# EAGLE schematic baord1 (EAGLE 7.2.0)
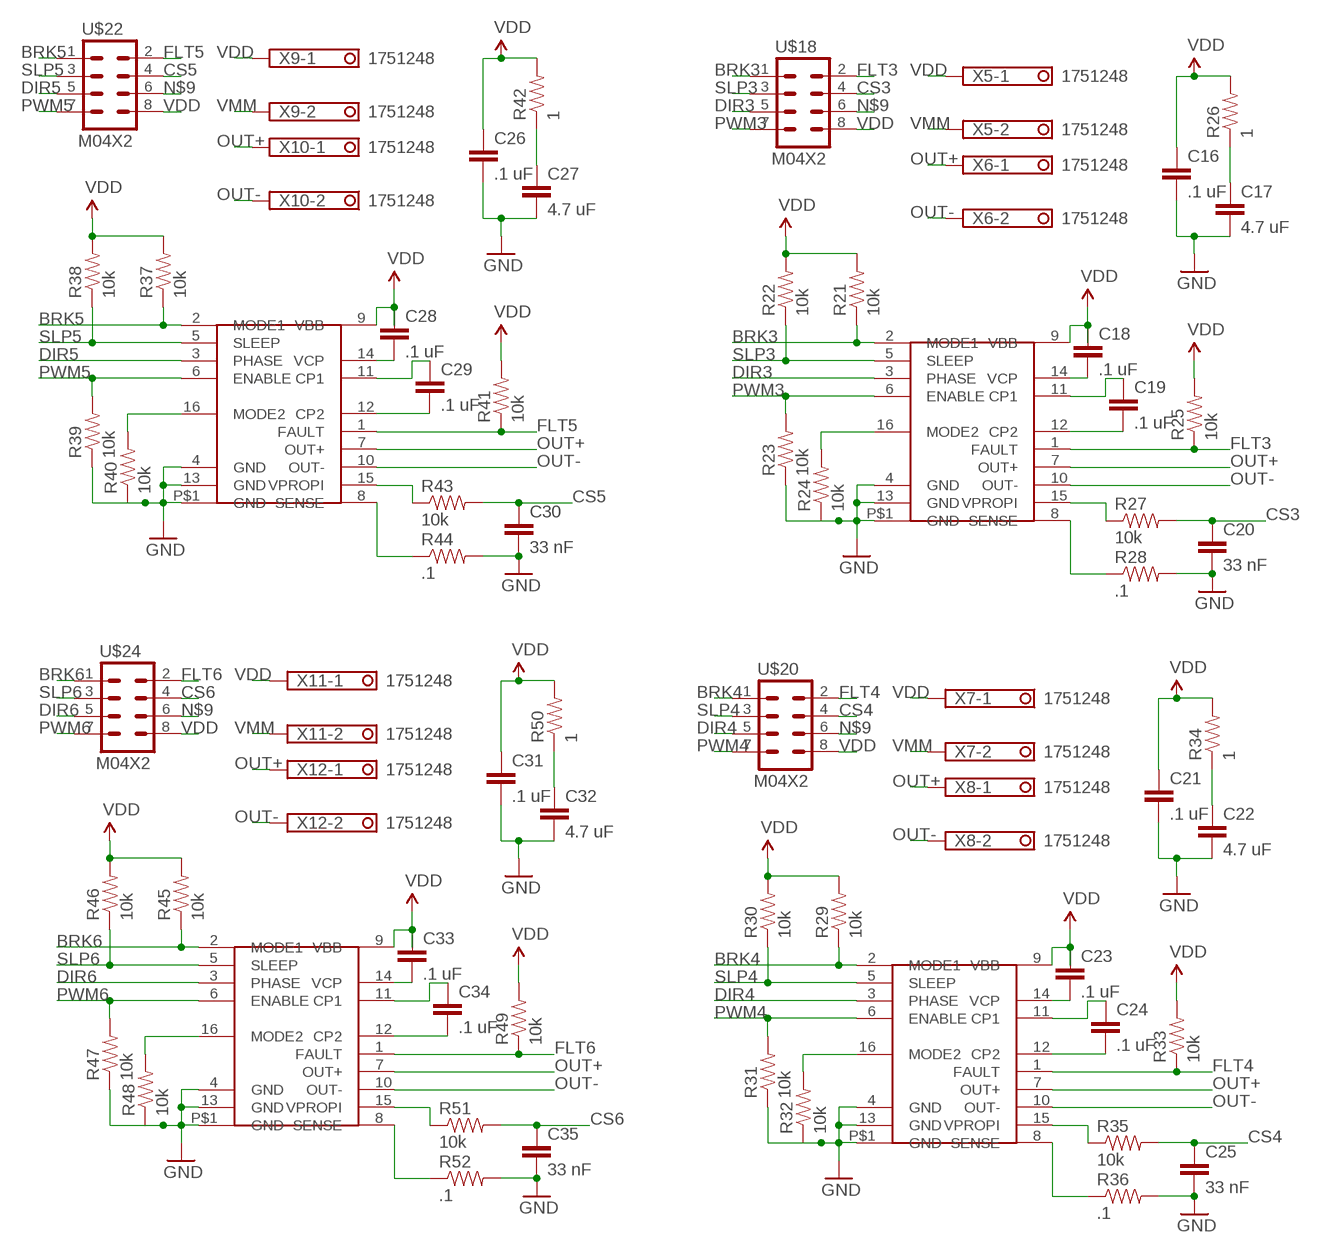
[diagram p0: schematic, sheet 1, part 1 of 2]
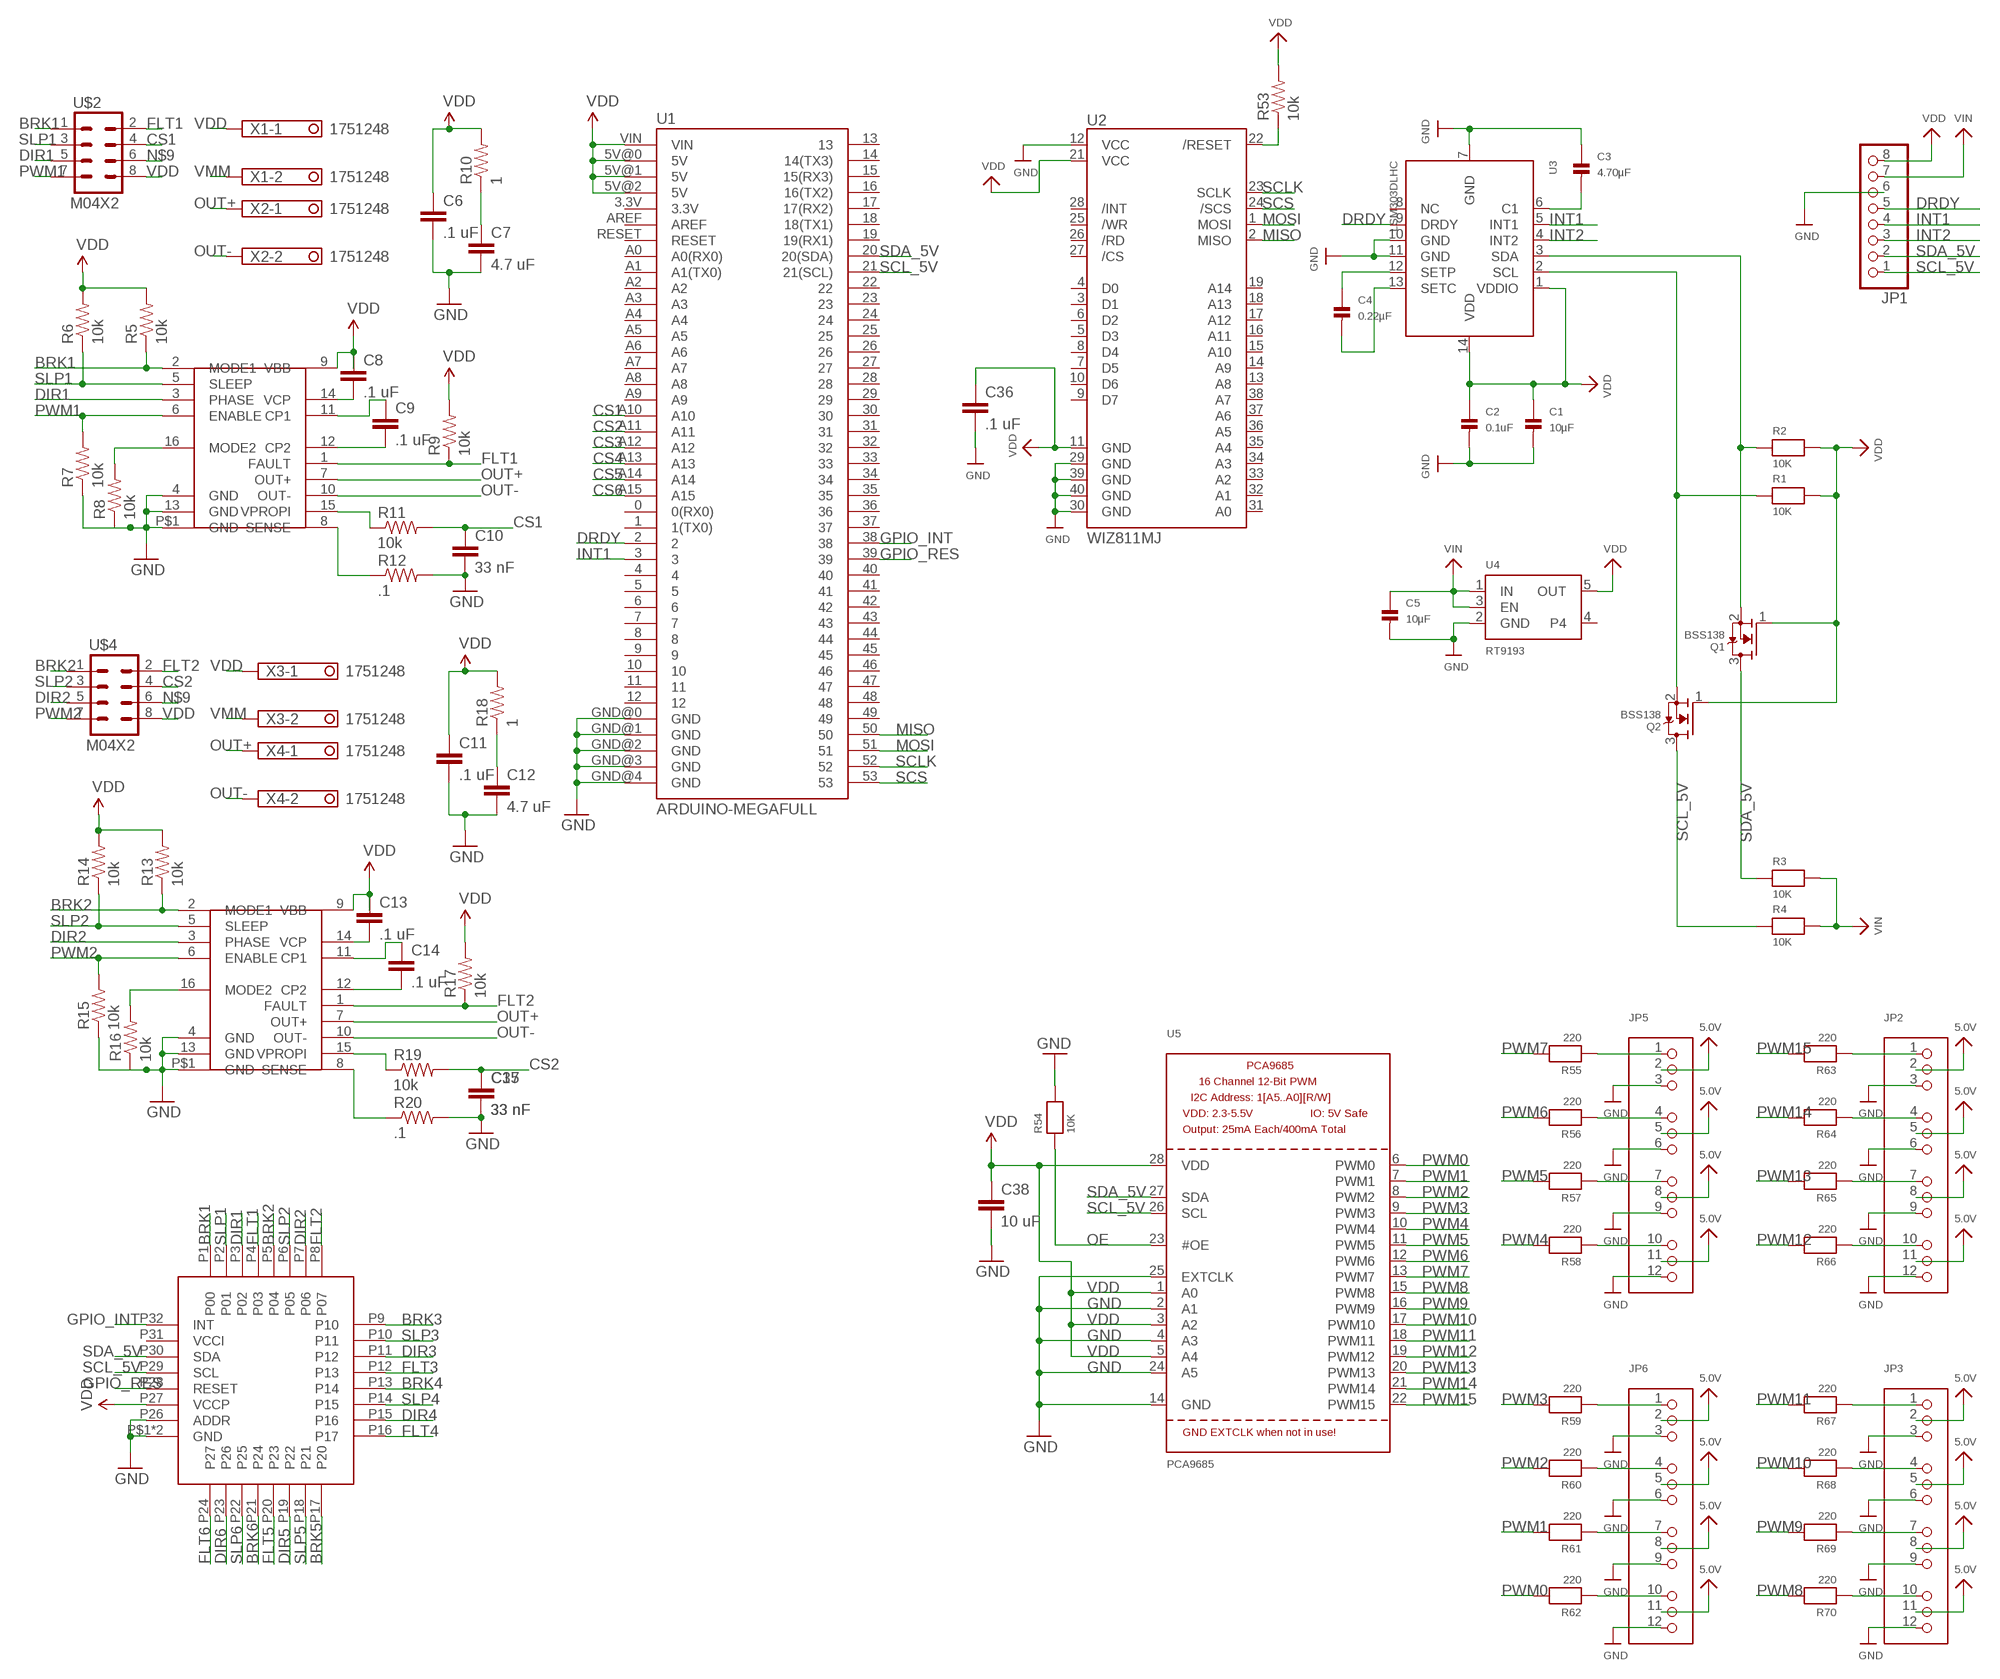
[diagram p1: schematic, sheet 1, part 2 of 2]

## Parts
C1  10µF  CAP_CERAMIC_0805  [_0805]
C2  0.1uF  CAP_CERAMIC_0805  [_0805]
C3  4.70µF  CAP_CERAMIC_0805  [_0805]
C4  0.22µF  CAP_CERAMIC_0805  [_0805]
C5  10µF  CAP_CERAMIC_0805  [_0805]
C6  .1 uF  CAPPTH  [CAP-PTH-SMALL]
C7  4.7 uF  CAPPTH  [CAP-PTH-SMALL]
C8  .1 uF  CAPPTH  [CAP-PTH-SMALL]
C9  .1 uF  CAPPTH  [CAP-PTH-SMALL]
C10  33 nF  CAPPTH  [CAP-PTH-SMALL]
C11  .1 uF  CAPPTH  [CAP-PTH-SMALL]
C12  4.7 uF  CAPPTH  [CAP-PTH-SMALL]
C13  .1 uF  CAPPTH  [CAP-PTH-SMALL]
C14  .1 uF  CAPPTH  [CAP-PTH-SMALL]
C15  33 nF  CAPPTH  [CAP-PTH-SMALL]
C16  .1 uF  CAPPTH  [CAP-PTH-SMALL]
C17  4.7 uF  CAPPTH  [CAP-PTH-SMALL]
C18  .1 uF  CAPPTH  [CAP-PTH-SMALL]
C19  .1 uF  CAPPTH  [CAP-PTH-SMALL]
C20  33 nF  CAPPTH  [CAP-PTH-SMALL]
C21  .1 uF  CAPPTH  [CAP-PTH-SMALL]
C22  4.7 uF  CAPPTH  [CAP-PTH-SMALL]
C23  .1 uF  CAPPTH  [CAP-PTH-SMALL]
C24  .1 uF  CAPPTH  [CAP-PTH-SMALL]
C25  33 nF  CAPPTH  [CAP-PTH-SMALL]
C26  .1 uF  CAPPTH  [CAP-PTH-SMALL]
C27  4.7 uF  CAPPTH  [CAP-PTH-SMALL]
C28  .1 uF  CAPPTH  [CAP-PTH-SMALL]
C29  .1 uF  CAPPTH  [CAP-PTH-SMALL]
C30  33 nF  CAPPTH  [CAP-PTH-SMALL]
C31  .1 uF  CAPPTH  [CAP-PTH-SMALL]
C32  4.7 uF  CAPPTH  [CAP-PTH-SMALL]
C33  .1 uF  CAPPTH  [CAP-PTH-SMALL]
C34  .1 uF  CAPPTH  [CAP-PTH-SMALL]
C35  33 nF  CAPPTH  [CAP-PTH-SMALL]
C36  .1 uF  CAPPTH  [CAP-PTH-SMALL]
C37  33 nF  CAPPTH  [CAP-PTH-SMALL]
C38  10 uF  CAPPTH  [CAP-PTH-SMALL]
JP1  HEADER-1X876MIL  [1X08_ROUND_76]
JP2  HEADER-3X04  [3X04]
JP3  HEADER-3X04  [3X04]
JP5  HEADER-3X04  [3X04]
JP6  HEADER-3X04  [3X04]
Q1  BSS138  MOSFET-NWIDE  [SOT23-WIDE]
Q2  BSS138  MOSFET-NWIDE  [SOT23-WIDE]
R1  10K  RESISTOR_0805  [_0805]
R2  10K  RESISTOR_0805  [_0805]
R3  10K  RESISTOR_0805  [_0805]
R4  10K  RESISTOR_0805  [_0805]
R5  10k  RESISTOR0603  [0603-RES]
R6  10k  RESISTOR0603  [0603-RES]
R7  10k  RESISTOR0603  [0603-RES]
R8  10k  RESISTOR0603  [0603-RES]
R9  10k  RESISTOR0603  [0603-RES]
R10  1  RESISTOR0603  [0603-RES]
R11  10k  RESISTOR0603  [0603-RES]
R12  .1  RESISTOR0603  [0603-RES]
R13  10k  RESISTOR0603  [0603-RES]
R14  10k  RESISTOR0603  [0603-RES]
R15  10k  RESISTOR0603  [0603-RES]
R16  10k  RESISTOR0603  [0603-RES]
R17  10k  RESISTOR0603  [0603-RES]
R18  1  RESISTOR0603  [0603-RES]
R19  10k  RESISTOR0603  [0603-RES]
R20  .1  RESISTOR0603  [0603-RES]
R21  10k  RESISTOR0603  [0603-RES]
R22  10k  RESISTOR0603  [0603-RES]
R23  10k  RESISTOR0603  [0603-RES]
R24  10k  RESISTOR0603  [0603-RES]
R25  10k  RESISTOR0603  [0603-RES]
R26  1  RESISTOR0603  [0603-RES]
R27  10k  RESISTOR0603  [0603-RES]
R28  .1  RESISTOR0603  [0603-RES]
R29  10k  RESISTOR0603  [0603-RES]
R30  10k  RESISTOR0603  [0603-RES]
R31  10k  RESISTOR0603  [0603-RES]
R32  10k  RESISTOR0603  [0603-RES]
R33  10k  RESISTOR0603  [0603-RES]
R34  1  RESISTOR0603  [0603-RES]
R35  10k  RESISTOR0603  [0603-RES]
R36  .1  RESISTOR0603  [0603-RES]
R37  10k  RESISTOR0603  [0603-RES]
R38  10k  RESISTOR0603  [0603-RES]
R39  10k  RESISTOR0603  [0603-RES]
R40  10k  RESISTOR0603  [0603-RES]
R41  10k  RESISTOR0603  [0603-RES]
R42  1  RESISTOR0603  [0603-RES]
R43  10k  RESISTOR0603  [0603-RES]
R44  .1  RESISTOR0603  [0603-RES]
R45  10k  RESISTOR0603  [0603-RES]
R46  10k  RESISTOR0603  [0603-RES]
R47  10k  RESISTOR0603  [0603-RES]
R48  10k  RESISTOR0603  [0603-RES]
R49  10k  RESISTOR0603  [0603-RES]
R50  1  RESISTOR0603  [0603-RES]
R51  10k  RESISTOR0603  [0603-RES]
R52  .1  RESISTOR0603  [0603-RES]
R53  10k  RESISTOR0603  [0603-RES]
R54  10K  RESISTOR_0805  [_0805]
R55  220  RESISTOR_0805  [_0805]
R56  220  RESISTOR_0805  [_0805]
R57  220  RESISTOR_0805  [_0805]
R58  220  RESISTOR_0805  [_0805]
R59  220  RESISTOR_0805  [_0805]
R60  220  RESISTOR_0805  [_0805]
R61  220  RESISTOR_0805  [_0805]
R62  220  RESISTOR_0805  [_0805]
R63  220  RESISTOR_0805  [_0805]
R64  220  RESISTOR_0805  [_0805]
R65  220  RESISTOR_0805  [_0805]
R66  220  RESISTOR_0805  [_0805]
R67  220  RESISTOR_0805  [_0805]
R68  220  RESISTOR_0805  [_0805]
R69  220  RESISTOR_0805  [_0805]
R70  220  RESISTOR_0805  [_0805]
U1  ARDUINO-MEGAFULL  [ARDUINO_MEGA]
U2  WIZ811MJ  [WIZ811MJ]
U3  LSM303DLHC  [LGA14]
U4  RT9193  VREG_SOT23-5  [SOT23-5]
U5  PCA9685  [TSSOP28]
U$1  DRV8801PWP  [TSSOP16]
U$2  M04X2  [2X4]
U$3  DRV8801PWP  [TSSOP16]
U$4  M04X2  [2X4]
U$17  DRV8801PWP  [TSSOP16]
U$18  M04X2  [2X4]
U$19  DRV8801PWP  [TSSOP16]
U$20  M04X2  [2X4]
U$21  DRV8801PWP  [TSSOP16]
U$22  M04X2  [2X4]
U$23  DRV8801PWP  [TSSOP16]
U$24  M04X2  [2X4]
U$63  TCA6424A  [PQFN32]
X1  1751248  [1751248]
X2  1751248  [1751248]
X3  1751248  [1751248]
X4  1751248  [1751248]
X5  1751248  [1751248]
X6  1751248  [1751248]
X7  1751248  [1751248]
X8  1751248  [1751248]
X9  1751248  [1751248]
X10  1751248  [1751248]
X11  1751248  [1751248]
X12  1751248  [1751248]

## Nets
5.0V: JP2.2 JP2.5 JP2.8 JP2.11 JP3.2 JP3.5 JP3.8 JP3.11 JP5.2 JP5.5 JP5.8 JP5.11 JP6.2 JP6.5 JP6.8 JP6.11
BRK1: R5.1 U$1.2(MODE1) U$2.1 U$63.P1(P00)
BRK2: R13.1 U$3.2(MODE1) U$4.1 U$63.P5(P04)
BRK3: R21.1 U$17.2(MODE1) U$18.1 U$63.P9(P10)
BRK4: R29.1 U$19.2(MODE1) U$20.1 U$63.P13(P14)
BRK5: R37.1 U$21.2(MODE1) U$22.1 U$63.P17(P20)
BRK6: R45.1 U$23.2(MODE1) U$24.1 U$63.P21(P24)
CS1: C10.1 R11.2 U1.A10 U$2.4
CS2: C15.1 C37.1 R19.2 U1.A11 U$4.4
CS3: C20.1 R27.2 U1.A12 U$18.4
CS4: C25.1 R35.2 U1.A13 U$20.4
CS5: C30.1 R43.2 U1.A14 U$22.4
CS6: C35.1 R51.2 U1.A15 U$24.4
DIR1: U$1.3(PHASE) U$2.5 U$63.P3(P02)
DIR2: U$3.3(PHASE) U$4.5 U$63.P7(P06)
DIR3: U$17.3(PHASE) U$18.5 U$63.P11(P12)
DIR4: U$19.3(PHASE) U$20.5 U$63.P15(P16)
DIR5: U$21.3(PHASE) U$22.5 U$63.P19(P22)
DIR6: U$23.3(PHASE) U$24.5 U$63.P23(P26)
DRDY: JP1.5 U1.2 U3.9(DRDY)
FLT1: R9.1 U$1.1(FAULT) U$2.2 U$63.P4(P03)
FLT2: R17.1 U$3.1(FAULT) U$4.2 U$63.P8(P07)
FLT3: R25.1 U$17.1(FAULT) U$18.2 U$63.P12(P13)
FLT4: R33.1 U$19.1(FAULT) U$20.2 U$63.P16(P17)
FLT5: R41.1 U$21.1(FAULT) U$22.2 U$63.P20(P23)
FLT6: R49.1 U$23.1(FAULT) U$24.2 U$63.P24(P27)
GND: C1.2 C2.2 C3.1 C5.2 C6.2 C7.2 C10.2 C11.2 C12.2 C15.2 C16.2 C17.2 C20.2 C21.2 C22.2 C25.2 C26.2 C27.2 C30.2 C31.2 C32.2 C35.2 C36.2 C37.2 C38.2 JP1.6 JP2.3 JP2.6 JP2.9 JP2.12 JP3.3 JP3.6 JP3.9 JP3.12 JP5.3 JP5.6 JP5.9 JP5.12 JP6.3 JP6.6 JP6.9 JP6.12 R7.1 R8.1 R12.2 R15.1 R16.1 R20.2 R23.1 R24.1 R28.2 R31.1 R32.1 R36.2 R39.1 R40.1 R44.2 R47.1 R48.1 R52.2 R54.2 U1.GND@0(GND) U1.GND@1(GND) U1.GND@2(GND) U1.GND@3(GND) U1.GND@4(GND) U2.12(VCC) U2.29(GND) U2.30(GND) U2.39(GND) U2.40(GND) U3.7(GND) U3.10(GND) U3.11(GND) U4.2(GND) U5.2(A1) U5.4(A3) U5.14(GND) U5.24(A5) U5.25(EXTCLK) U$1.4(GND) U$1.13(GND) U$1.P$1(GND) U$3.4(GND) U$3.13(GND) U$3.P$1(GND) U$17.4(GND) U$17.13(GND) U$17.P$1(GND) U$19.4(GND) U$19.13(GND) U$19.P$1(GND) U$21.4(GND) U$21.13(GND) U$21.P$1(GND) U$23.4(GND) U$23.13(GND) U$23.P$1(GND) U$63.P25(GND) U$63.P26(ADDR) U$63.P$1(GND)
GPIO_INT: U1.38 U$63.P32(INT)
GPIO_RES: U1.39 U$63.P28(RESET)
INT1: JP1.4 U1.3 U3.5(INT1)
INT2: JP1.3 U3.4(INT2)
MISO: U1.50 U2.2(MISO)
MOSI: U1.51 U2.1(MOSI)
N$1: Q1.2(S) R2.1 U3.3(SDA)
N$2: Q2.2(S) R1.1 U3.2(SCL)
N$3: C3.2 U3.6(C1)
N$4: C4.1 U3.12(SETP)
N$5: C4.2 U3.13(SETC)
N$6: R8.2 U$1.16(MODE2)
N$7: R12.1 U$1.8(SENSE)
N$8: R19.1 U$3.15(VPROPI)
N$9: U$2.6 U$4.6 U$18.6 U$20.6 U$22.6 U$24.6
N$10: C13.2 U$3.14(VCP)
N$11: C14.1 U$3.11(CP1)
N$12: C14.2 U$3.12(CP2)
N$13: C12.1 R18.1
N$14: R16.2 U$3.16(MODE2)
N$15: R20.1 U$3.8(SENSE)
N$16: R11.1 U$1.15(VPROPI)
N$17: R27.1 U$17.15(VPROPI)
N$18: C8.2 U$1.14(VCP)
N$19: C9.1 U$1.11(CP1)
N$20: C9.2 U$1.12(CP2)
N$21: C18.2 U$17.14(VCP)
N$22: C7.1 R10.1
N$23: C19.1 U$17.11(CP1)
N$24: C19.2 U$17.12(CP2)
N$25: C17.1 R26.1
N$26: R24.2 U$17.16(MODE2)
N$27: R28.1 U$17.8(SENSE)
N$28: R35.1 U$19.15(VPROPI)
N$29: C23.2 U$19.14(VCP)
N$30: C24.1 U$19.11(CP1)
N$31: C24.2 U$19.12(CP2)
N$32: C22.1 R34.1
N$33: R32.2 U$19.16(MODE2)
N$34: R36.1 U$19.8(SENSE)
N$35: R43.1 U$21.15(VPROPI)
N$36: C28.2 U$21.14(VCP)
N$37: C29.1 U$21.11(CP1)
N$38: C29.2 U$21.12(CP2)
N$39: C27.1 R42.1
N$40: R40.2 U$21.16(MODE2)
N$41: R44.1 U$21.8(SENSE)
N$42: R51.1 U$23.15(VPROPI)
N$43: C33.2 U$23.14(VCP)
N$44: C34.1 U$23.11(CP1)
N$45: C34.2 U$23.12(CP2)
N$46: C32.1 R50.1
N$47: R48.2 U$23.16(MODE2)
N$48: R52.1 U$23.8(SENSE)
N$49: R53.1 U2.22(/RESET)
N$50: JP3.10 R70.1
N$51: JP3.7 R69.1
N$52: JP6.10 R62.1
N$53: JP6.7 R61.1
N$54: JP6.4 R60.1
N$55: JP6.1 R59.1
N$56: JP5.10 R58.1
N$57: JP5.7 R57.1
N$58: JP5.4 R56.1
N$59: JP5.1 R55.1
N$60: JP3.4 R68.1
N$61: JP3.1 R67.1
N$62: JP2.10 R66.1
N$63: JP2.7 R65.1
N$64: JP2.4 R64.1
N$65: JP2.1 R63.1
OE: R54.1 U5.23(#OE)
OUT+: U$1.7(OUT+) U$3.7(OUT+) U$17.7(OUT+) U$19.7(OUT+) U$21.7(OUT+) U$23.7(OUT+) X2.1 X4.1 X6.1 X8.1 X10.1 X12.1
OUT-: U$1.10(OUT-) U$3.10(OUT-) U$17.10(OUT-) U$19.10(OUT-) U$21.10(OUT-) U$23.10(OUT-) X2.2 X4.2 X6.2 X8.2 X10.2 X12.2
PWM0: R62.2 U5.6(PWM0)
PWM1: R7.2 R61.2 U5.7(PWM1) U$1.6(ENABLE) U$2.7
PWM2: R15.2 R60.2 U5.8(PWM2) U$3.6(ENABLE) U$4.7
PWM3: R23.2 R59.2 U5.9(PWM3) U$17.6(ENABLE) U$18.7
PWM4: R31.2 R58.2 U5.10(PWM4) U$19.6(ENABLE) U$20.7
PWM5: R39.2 R57.2 U5.11(PWM5) U$21.6(ENABLE) U$22.7
PWM6: R47.2 R56.2 U5.12(PWM6) U$23.6(ENABLE) U$24.7
PWM7: R55.2 U5.13(PWM7)
PWM8: R70.2 U5.15(PWM8)
PWM9: R69.2 U5.16(PWM9)
PWM10: R68.2 U5.17(PWM10)
PWM11: R67.2 U5.18(PWM11)
PWM12: R66.2 U5.19(PWM12)
PWM13: R65.2 U5.20(PWM13)
PWM14: R64.2 U5.21(PWM14)
PWM15: R63.2 U5.22(PWM15)
SCL_5V: JP1.1 Q2.3(D) R4.1 U1.21(21(SCL)) U5.26(SCL) U$63.P29(SCL)
SCLK: U1.52 U2.23(SCLK)
SCS: U1.53 U2.24(/SCS)
SDA_5V: JP1.2 Q1.3(D) R3.1 U1.20(20(SDA)) U5.27(SDA) U$63.P30(SDA)
SLP1: R6.1 U$1.5(SLEEP) U$2.3 U$63.P2(P01)
SLP2: R14.1 U$3.5(SLEEP) U$4.3 U$63.P6(P05)
SLP3: R22.1 U$17.5(SLEEP) U$18.3 U$63.P10(P11)
SLP4: R30.1 U$19.5(SLEEP) U$20.3 U$63.P14(P15)
SLP5: R38.1 U$21.5(SLEEP) U$22.3 U$63.P18(P21)
SLP6: R46.1 U$23.5(SLEEP) U$24.3 U$63.P22(P25)
VDD: C1.1 C2.1 C6.1 C8.1 C11.1 C13.1 C16.1 C18.1 C21.1 C23.1 C26.1 C28.1 C31.1 C33.1 C36.1 C38.1 JP1.8 Q1.1(G) Q2.1(G) R1.2 R2.2 R5.2 R6.2 R9.2 R10.2 R13.2 R14.2 R17.2 R18.2 R21.2 R22.2 R25.2 R26.2 R29.2 R30.2 R33.2 R34.2 R37.2 R38.2 R41.2 R42.2 R45.2 R46.2 R49.2 R50.2 R53.2 U1.5V@0(5V) U1.5V@1(5V) U1.5V@2(5V) U1.VIN U2.11(GND) U2.21(VCC) U3.1(VDDIO) U3.14(VDD) U4.5(OUT) U5.1(A0) U5.3(A2) U5.5(A4) U5.28(VDD) U$1.9(VBB) U$2.8 U$3.9(VBB) U$4.8 U$17.9(VBB) U$18.8 U$19.9(VBB) U$20.8 U$21.9(VBB) U$22.8 U$23.9(VBB) U$24.8 U$63.P27(VCCP) X1.1 X3.1 X5.1 X7.1 X9.1 X11.1
VIN: C5.1 JP1.7 R3.2 R4.2 U4.1(IN) U4.3(EN)
VMM: X1.2 X3.2 X5.2 X7.2 X9.2 X11.2
Unconnected: U1.0(0(RX0)) U1.1(1(TX0)) U1.3.3V U1.4 U1.5 U1.6 U1.7 U1.8 U1.9 U1.10 U1.11 U1.12 U1.13 U1.14(14(TX3)) U1.15(15(RX3)) U1.16(16(TX2)) U1.17(17(RX2)) U1.18(18(TX1)) U1.19(19(RX1)) U1.22 U1.23 U1.24 U1.25 U1.26 U1.27 U1.28 U1.29 U1.30 U1.31 U1.32 U1.33 U1.34 U1.35 U1.36 U1.37 U1.40 U1.41 U1.42 U1.43 U1.44 U1.45 U1.46 U1.47 U1.48 U1.49 U1.A0(A0(RX0)) U1.A1(A1(TX0)) U1.A2 U1.A3 U1.A4 U1.A5 U1.A6 U1.A7 U1.A8 U1.A9 U1.AREF U1.RESET U2.3(D1) U2.4(D0) U2.5(D3) U2.6(D2) U2.7(D5) U2.8(D4) U2.9(D7) U2.10(D6) U2.13(A8) U2.14(A9) U2.15(A10) U2.16(A11) U2.17(A12) U2.18(A13) U2.19(A14) U2.25(/WR) U2.26(/RD) U2.27(/CS) U2.28(/INT) U2.31(A0) U2.32(A1) U2.33(A2) U2.34(A3) U2.35(A4) U2.36(A5) U2.37(A6) U2.38(A7) U3.8(NC) U4.4 U$63.P31(VCCI)

## Library data of the parts
C1-C5 = microbuilder:CAP_CERAMIC: Ceramic Capacitors 0402 - 0402 Surface Mount Capacitors 16pF 50V 5% [Digikey: 445-4899-2-ND] 18pF 50V 5% [Digikey: 490-1281-2-ND] 22pF 50V 5% [Digikey: 490-1283-2-ND] 68pF 50V 5% [Digikey: 490-1289-2-ND] 0.1uF 10V 10% [Digikey: 490-1318-2-ND] 1.0uF 6.3V 10% [Digikey: 490-1320-2-ND] 0603 - 0603 Surface Mount Capacitors 16 pF 50V 5% [Digikey: 445-5051-2-ND] 22 pF 50V [Digikey: PCC220ACVTR-ND] 33 pF 50V 5% [Digikey: 490-1415-1-ND] 56pF 50V 5% [Digikey: 490-1421-1-ND] 220pF 50V 5% [Digikey: 445-1285-1-ND] 680 pF 50V 2200 pF 50V 5% C0G [Digikey: 445-1297-1-ND] 5600 pF 100V 5% X7R [Digikey: 478-3711-1-ND] 0.1 µF 25V 10% [Digikey: PCC2277TR-ND] 0.22 µF 16V 10% X7R [Digikey: 445-1318-1-ND] 1.0 µF 25V 10% [Digikey: 445-5146-2-ND] 0603 - RF Specific 3pF 250V +/-0.1pF RF [Digikey: 712-1347-1-ND] 18 pF 250V 5% [Digikey: 478-3505-1-ND or 712-1322-1-ND] 56 pF 250V 5% C0G RF [Digikey: 490-4867-1-ND] 68 pF 250V RF [Digikey: 490-4868-1-ND] 0805 - 0805 Surface Mount Capacitors 220 pF 250V 2% RF Ceramic Capacitor [Digikey: 712-1398-1-ND] 1000 pF 50V 2% NP0 Ceramic Capacitor [Digikey: 478-3760-1-ND] 0.1 µF 25V 10% Ceramic Capacitor [Digikey: PCC1828TR-ND] 1.0 µF 16V 10% Ceramic Capacitor[Digikey: 490-1691-2-ND] 10.0 µF 10V 10% Ceramic Capacitor[Digikey: 709-1228-1-ND] 10.0 uF 16V 10% Ceramic Capacitor [Digikey: 478-5165-2-ND] 47 uF 6.3V 20% Ceramic Capacitor [Digikey: 587-1779-1-ND or 399-5506-1-ND] 1206 - 1206 Surface Mount Capacitors 47uF 10V 20% Ceramic Capacitor [Digikey: 490-5528-1-ND or 399-5508-1-ND or 445-6010-1-ND] 100uF 6.3V -20%, +80% Y5V Ceramic Capacitor (Digikey: 490-4512-1-ND, Mouser: 81-GRM31CF50J107ZE1L)
C6-C38 = SparkFun-Capacitors:CAP: Capacitor Standard 0603 ceramic capacitor, and 0.1" leaded capacitor.
JP1 = microbuilder:HEADER-1X8: PIN HEADER
JP2 JP3 JP5 JP6 = microbuilder:HEADER-3X04
Q1 Q2 = microbuilder:MOSFET-N: N-Channel Mosfet LEGEND VDS: Voltage Drain-Source ID: Drain Current RDS(ON): Drain-Source On-State Resistance VGS(TH): Gate-Source Threshold Voltage CISS: Drain-Source Input Capacitance SOT-23 Name VDS ID RDS(ON) VGS(TH) CISS Order Number 2N7002E 60V 260mA 2.5 Ohm 2.5V @ 250uA 26.7pF @ 25V 2N7002ET1GOSTR-ND BSH103 30V 850mA 400 mOhm 400mV @ 1mA 83pF @ 24V BSH103,235-ND BSS138 60V 320mA 1.6 Ohm 1.5V @ 250uA 50pF @ 10V Mouser: 771-BSS138PW115 DMN2075U-7 20V 4.2A 38 mOhm 1V @ 250 uA 594.3pF @ 10V DMN2075U-7DICT-ND * BSS138 good choice for I2C level-shifting
R1-R4 R54-R70 = microbuilder:RESISTOR: Resistors 0402 - 0402 Surface Mount Package 22 Ohm 1% 1/16W [Digikey: 311-22.0LRTR-ND] 33 Ohm 5% 1/16W 1.0K 5% 1/16W 1.5K 5% 1/16W 2.0K 1% 1/16W 10.0K 1% 1/16W [Digikey: 311-10.0KLRTR-ND] 10.0K 5% 1/16W [Digikey: RMCF0402JT10K0TR-ND] 12.1K 1% 1/16W [Digikey: 311-22.0LRTR-ND] 100.0K 5% 1/16W 0603 - 0603 Surface Mount Package 0 Ohm 1/10 Watt 1% Resistor 15 Ohm 1/10 Watt 1% Resistor 33 Ohm 1/10 Watt 1% Resistor 49.9 Ohm 1/10 Watt 1% Resistor 100 Ohm 1/10 Watt 1% Resistor 150 Ohm 1/10 Watt 1% Resistor 240 Ohm 1/10 Watt 1% Resistor 390 Ohm 1/10 Watt 1% Resistor 560 Ohm 1/10 Watt 1% Resistor 680 Ohm 1/10 Watt 1% Resistor 750 Ohm 1/10 Watt 1% Resistor 1.0K Ohm 1/10 Watt 1% Resistor 1.5K Ohm 1/10 Watt 1% Resistor 2.0K Ohm 1/10 Watt 1% Resistor 2.2K Ohm 1/10 Watt 1% Resistor 3.3K Ohm 1/10 Watt 1% Resistor 4.7K Ohm 1/10 Watt 1% Resistor 10.0K Ohm 1/10 Watt 1% Resistor 12.0K Ohm 1/10 Watt 1% Resistor 12.1K Ohm 1/10 Watt 1% Resistor 20.0K Ohm 1/10 Watt 1% Resistor 33.0K Ohm 1/10 Watt 1% Resistor 100.0K Ohm 1/10 Watt 1% Resistor 0805 - 0805 Surface Mount Package 0 Ohm 1/8 Watt 1% Resistor 33 Ohm 1/8 Watt 1% Resistor 100 Ohm 1/8 Watt 1% Resistor 150 Ohm 1/8 Watt 1% Resistor 200 Ohm 1/8 Watt 1% Resistor 240 Ohm 1/8 Watt 1% Resistor 330 Ohm 1/8 Watt 1% Resistor 390 Ohm 1/8 Watt 1% Resistor 470 Ohm 1/8 Watt 1% Resistor 1.0K Ohm 1/8 Watt 1% Resistor 1.5K Ohm 1/8 Watt 1% Resistor 2.0K Ohm 1/8 Watt 1% Resistor 4.7K Ohm 1/8 Watt 1% Resistor 5.1K Ohm 1/8 Watt 1% Resistor 5.6K Ohm 1/8 Watt 1% Resistor 10.0K Ohm 1/8 Watt 1% Resistor 22.0K Ohm 1/8 Watt 1% Resistor 33.0K Ohm 1/8 Watt 1% Resistor 100K Ohm 1/8 Watt 1% Resistor 1206 - 1206 Surface Mount Package 2012 - 2010 Surface Mount Package 0.11 Ohm 1/2 Watt 1% Resistor - Digikey: RHM.11UCT-ND
R5-R53 = SparkFun-Resistors:RESISTOR: Resistor Basic schematic elements and footprints for 0603, 1206, and PTH resistors.
U1 = SparkFun-Boards:ARDUINO-MEGA: Arduino Mega board footprint
U2 = SparkFun-Boards:WIZ811MJ: WIZnet W5100 Network Module with MagJack - WIZ811MJ WIZnet's WIZ811MJ is a breakout board for the W5100 embedded TCP/IP chip. Also included on the board is a RJ-45 MagJack Connector (RJ45 with X'FMR). See http://www.sparkfun.com/commerce/product_info.php?products_id=9473 for more documentation and info. **UNPROVEN
U3 = microbuilder:LSM303DLHC: LSM303DLHC 3-Axis I2C Accelerometer and 3-Axis Magnetometer VDD: 2.2-3.6V VDDIO: 1.8-VDD Magnetic Range: +/-1.3 to +/-8.1 gauss Accel Range: +/-2/4/8/16 g Temp: -40 - 85°C
U4 = microbuilder:VREG_SOT23-5: SOT23-5 Fixed Voltage Regulators To better organise some of the SOT23-5 fixed voltage regulators in this library, this new part was created. Part Current Out V Out V In V Dropout Digikey Part No. ADP121 150mA 3.3V 3.4-5.5V 0.09V @ 150mA ADP121-AUJZ33R7CT-ND ADP121 150mA 3.0V 3.1-5.5V 0.09V @ 150mA ADP121-AUJZ30R7CT-ND ADP122 300mA 3.3V 3.4-5.5V 0.085V @ 300mA ADP122AUJZ-3.3-R7CT-ND ADP1712 300mA 3.3V 3.5-5.5V 0.17V @ 300mA ADP1712AUJZ-3.3-R7TR-ND AP7311 (Low Cost) 150mA 3.3V 3.5-6V 0.15V @ 150mA AP7311-33WG-7DICT-ND LD39015M18R 150mA 1.8V 1.9V-5.5V 0.08V @ 100mA 497-6977-1-ND MCP1824T-3302E/OT 300mA 3.3V 3.5V-6V 0.2V @ 300mA MCP1824T-3302E/OTCT-ND MIC5205-2.5YM5 TR 150mA 2.5V 2.7-16V 0.165V @ 150mA 576-1257-2-ND MIC5205-3.0YM5 TR 150mA 3.0V 3.2V-16V 0.165V @ 150mA 576-1258-2-ND MIC5205-3.3YM5 TR 150mA 3.3V 3.5V-16V 0.165V @ 150mA 576-1259-2-ND TPS780330220 150mA 3.3V+2.2V 3.6-5.5V 250mV Max 296-23332-1-ND TDA3663/N1,135 100mA 3.3V 3.5-45V 0.18V @ 50mA 568-5343-1-ND
U5 = microbuilder:PCA9685: PCA9685 - 16 Channel 12-Bit I2C PWM Controller 5.0V tolerant 16 channel, 12-bit I2C PWM controller with 25mA per output (max. 400mA total) Digikey: 568-5931-1-ND
U$1 U$3 U$17 U$19 U$21 U$23 = neptune:DRV8801PWP
U$2 U$4 U$18 U$20 U$22 U$24 = SparkFun-Connectors:M04X2: .1" header, two rows of four.
U$63 = netpune:TCA6424A
X1-X12 = con-phoenix-350:1751248: MKDS 1/ 2-3,5 Printklemme Nennstrom: 10 A Bemessungsspannung: 160 V Raster: 3,5 mm Polzahl: 2 Montageart: Löten Anschlussart: Schraubanschluss Anschlussrichtung vom Leiter zur Platine: 0° Source: http://eshop.phoenixcontact.com .. 1751248.pdf; OC_FARNELL: unknown; OC_NEWARK: unknown